# EasyEDA schematic schematic.json
TITLE: Sheet_1; REV: 1.0; Date: 2024-07-17; Sheet: 1/1; Drawn By: micsaujoh; Company: Your Company
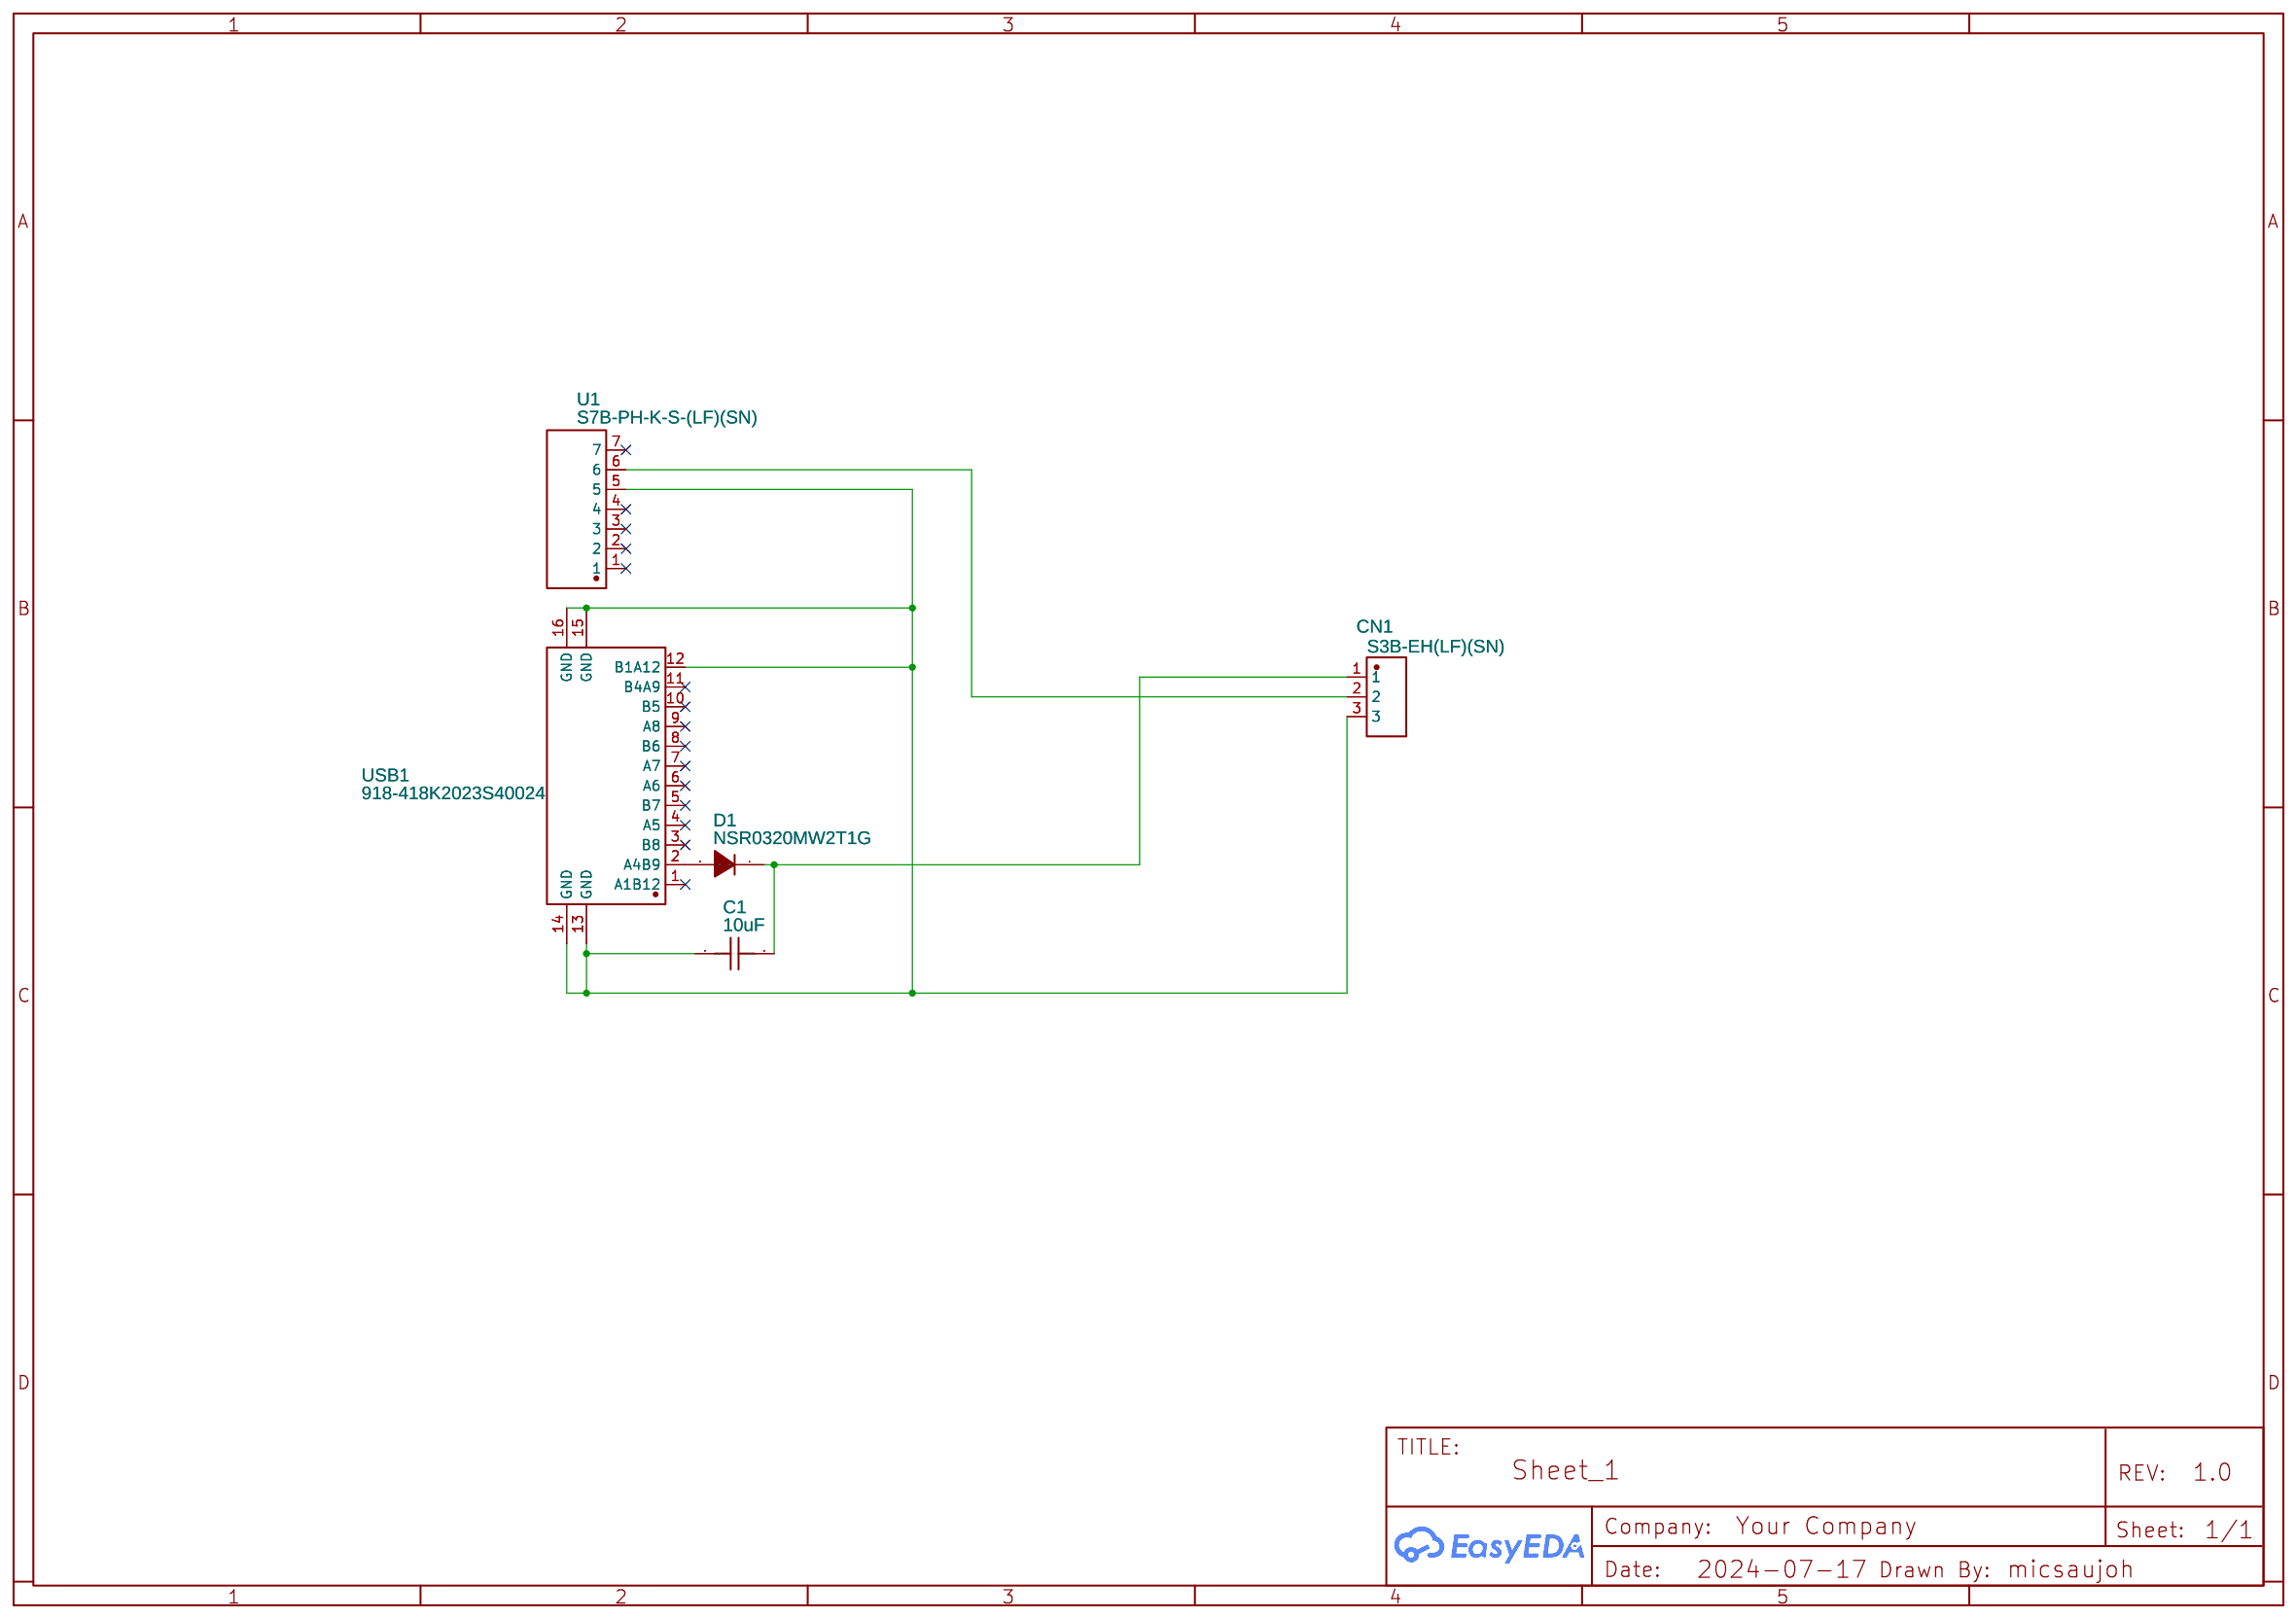
[diagram p0: schematic sheet]

## Parts
C1  10uF  [C0603]
CN1  S3B-EH(LF)(SN)  [CONN-TH_3P-P2.50_S3B-EH-LF-SN]
D1  NSR0320MW2T1G  [SOD-323_L1.8-W1.3-LS2.5-RD]
U1  S7B-PH-K-S-(LF)(SN)  [CONN-TH_7P-P2.00_S7B-PH-K-S-LF-SN]
USB1  918-418K2023S40024  [USB-C-SMD_918-418K2023S40024]

## Library data of the parts
C1 = CL10A106KP8NNNC: Supplier: LCSC; Manufacturer: SAMSUNG(三星); Supplier Part: C19702; JLCPCB Part Class: Basic Part
CN1 = S3B-EH(LF)(SN): Contributor: LCSC; Supplier: LCSC; Supplier Part: C263754; Manufacturer: JST; JLCPCB Part Class: Extended Part
D1 = NSR0320MW2T1G: Supplier: LCSC; Manufacturer: onsemi(安森美); Supplier Part: C48192; JLCPCB Part Class: Extended Part
U1 = S7B-PH-K-S-(LF)(SN): Contributor: LCSC; Supplier: LCSC; Supplier Part: C157917; Manufacturer: JST; Manufacturer Part: S7B-PH-K-S(LF)(SN); JLCPCB Part Class: Extended Part
USB1 = 918-418K2023S40024: Contributor: LCSC; Supplier: LCSC; Supplier Part: C709028; Manufacturer: 精拓金; JLCPCB Part Class: Extended Part

## Nets
Net-(C1-1): C1.1 CN1.3 U1.5 USB1.12(B1A12) USB1.13(GND) USB1.14(GND) USB1.15(GND) USB1.16(GND)
Net-(C1-2): C1.2 CN1.1 D1.1(C)
Net-(CN1-2): CN1.2 U1.6
Net-(D1-2): D1.2(A) USB1.2(A4B9)

Not connected (* = marked no-connect by the designer): U1 1* 2* 3* 4* 7*; USB1 1(A1B12)* 3(B8)* 4(A5)* 5(B7)* 6(A6)* 7(A7)* 8(B6)* 9(A8)* 10(B5)* 11(B4A9)*
